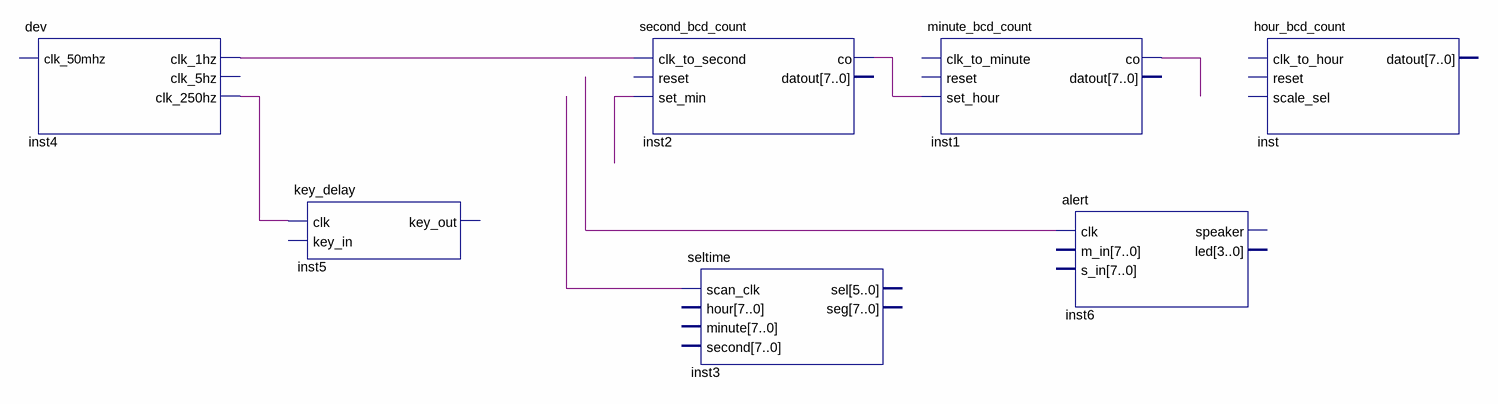
[diagram p0: schematic sheet]
// Quartus schematic top.bdf as structural Verilog: 7 symbols, 0 pins
module top (
);

  wire inst1_co, inst2_co, inst4_clk_1hz, inst4_clk_250hz, undriven, undriven_2, undriven_3;

  dev inst4 (.clk_1hz(inst4_clk_1hz), .clk_250hz(inst4_clk_250hz));  // open: clk_50mhz, clk_5hz
  key_delay inst5 (.clk(inst4_clk_250hz));  // open: key_in, key_out
  second_bcd_count inst2 (.clk_to_second(inst4_clk_1hz), .set_min(undriven_3), .co(inst2_co));  // open: reset, datout
  seltime inst3 (.scan_clk(undriven));  // open: hour, minute, second, sel, seg
  minute_bcd_count inst1 (.set_hour(inst2_co), .co(inst1_co));  // open: clk_to_minute, reset, datout
  alert inst6 (.clk(undriven_2));  // open: m_in, s_in, speaker, led
  hour_bcd_count inst ();  // open: clk_to_hour, reset, scale_sel, datout
endmodule
